# EAGLE design TinyRGBSignEdge (EAGLE 6.5.0)
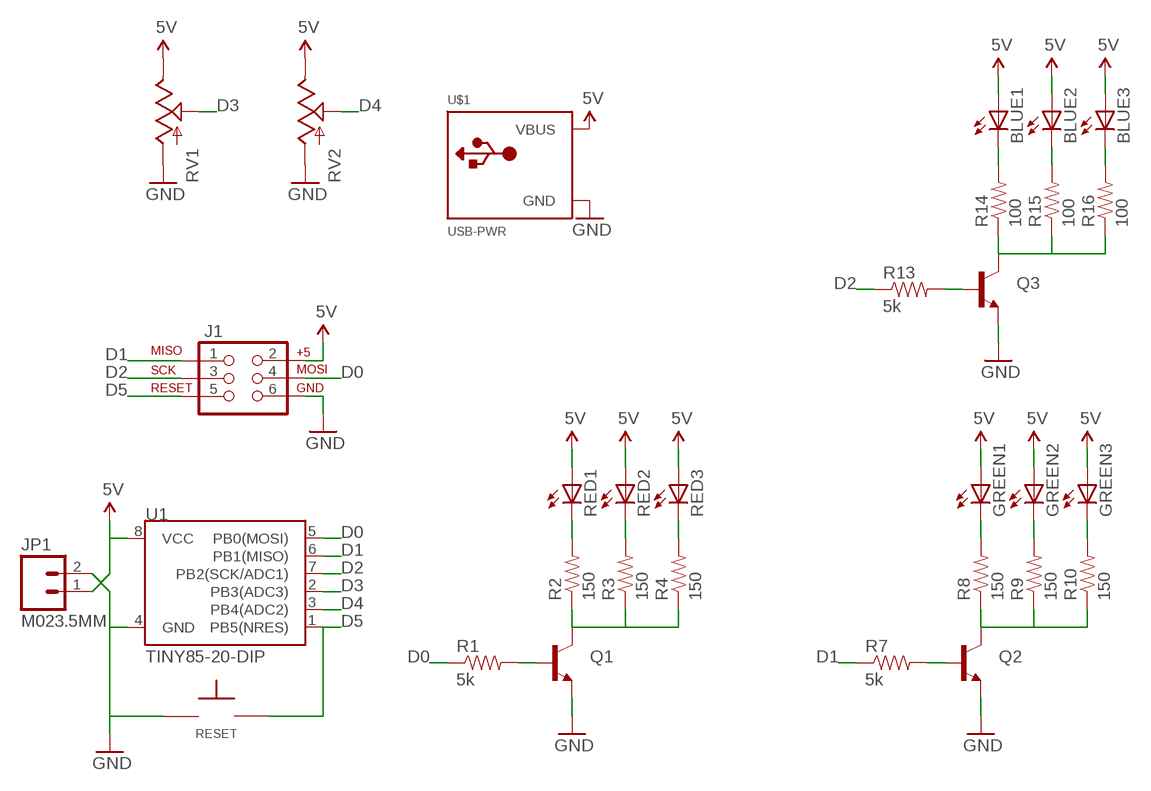
[diagram p0: schematic, sheet 1]

## Parts
BLUE1  LED5MM  [LED5MM]
BLUE2  LED5MM  [LED5MM]
BLUE3  LED5MM  [LED5MM]
GREEN1  LED5MM  [LED5MM]
GREEN2  LED5MM  [LED5MM]
GREEN3  LED5MM  [LED5MM]
J1  AVR_SPI_PRG_6PTH  [2X3]
JP1  M023.5MM  [SCREWTERMINAL-3.5MM-2]
Q1  TRANSISTOR_NPNTO-92-AMMO  [TO-92-AMMO]
Q2  TRANSISTOR_NPNTO-92-AMMO  [TO-92-AMMO]
Q3  TRANSISTOR_NPNTO-92-AMMO  [TO-92-AMMO]
R1  5k  RESISTORAXIAL-0.3  [AXIAL-0.3]
R2  150  RESISTORAXIAL-0.3  [AXIAL-0.3]
R3  150  RESISTORAXIAL-0.3  [AXIAL-0.3]
R4  150  RESISTORAXIAL-0.3  [AXIAL-0.3]
R7  5k  RESISTORAXIAL-0.3  [AXIAL-0.3]
R8  150  RESISTORAXIAL-0.3  [AXIAL-0.3]
R9  150  RESISTORAXIAL-0.3  [AXIAL-0.3]
R10  150  RESISTORAXIAL-0.3  [AXIAL-0.3]
R13  5k  RESISTORAXIAL-0.3  [AXIAL-0.3]
R14  100  RESISTORAXIAL-0.3  [AXIAL-0.3]
R15  100  RESISTORAXIAL-0.3  [AXIAL-0.3]
R16  100  RESISTORAXIAL-0.3  [AXIAL-0.3]
RED1  LED5MM  [LED5MM]
RED2  LED5MM  [LED5MM]
RED3  LED5MM  [LED5MM]
RESET  TAC_SPST_NO  [TAC_SPST_NO]
RV1  POTTRIM  [TRIM_POT]
RV2  POTTRIM  [TRIM_POT]
U1  TINY85-20-DIP  ATTINY45TINY85-20-DIP  [DIP08]
U$1  USB-PWR  [USB-MINIB-THM-MOLEX-PWRONLY]

## Nets
5V: BLUE1.A BLUE2.A BLUE3.A GREEN1.A GREEN2.A GREEN3.A J1.2 JP1.1 RED1.A RED2.A RED3.A RV1.2(E) RV2.2(E) U1.8(VCC) U$1.VBUS
BLUE2: BLUE2.K(C) R15.P$2
D0: J1.4 R1.P$1 U1.5(PB0(MOSI))
D1: J1.1 R7.P$1 U1.6(PB1(MISO))
D2: J1.3 R13.P$1 U1.7(PB2(SCK/ADC1))
D3: RV1.1(S) U1.2(PB3(ADC3))
D4: RV2.1(S) U1.3(PB4(ADC2))
D5: J1.5 RESET.P$2 U1.1(PB5(NRES))
GND: J1.6 JP1.2 Q1.1(E) Q2.1(E) Q3.1(E) RESET.P$1 RV1.3(A) RV2.3(A) U1.4(GND) U$1.GND
GREEN1: GREEN1.K(C) R8.P$2
N$2: Q1.2(B) R1.P$2
N$4: R2.P$2 RED1.K(C)
N$5: R3.P$2 RED2.K(C)
N$10: Q1.3(C) R2.P$1 R3.P$1 R4.P$1
N$12: Q2.2(B) R7.P$2
N$14: GREEN2.K(C) R9.P$2
N$15: GREEN3.K(C) R10.P$2
N$17: Q2.3(C) R8.P$1 R9.P$1 R10.P$1
N$19: Q3.2(B) R13.P$2
N$20: BLUE1.K(C) R14.P$2
N$22: BLUE3.K(C) R16.P$2
N$24: Q3.3(C) R14.P$1 R15.P$1 R16.P$1
RED3: R4.P$2 RED3.K(C)

## Library data of the parts
BLUE1-BLUE3 GREEN1-GREEN3 RED1-RED3 = barbary_enterprises:LED: LEDs Standard schematic elements and footprints for 5mm, 3mm, 1206, and 0603 sized LEDs. 5mm - Spark Fun Electronics SKU : COM-00529 (and others)
J1 = barbary_enterprises:AVR_SPI_PRG_6: AVR ISP 6 Pin This is the reduced ISP connector for AVR programming. Common on Arduino. This footprint will take up less PCB space and can be used with a 10-pin to 6-pin adapter such as SKU: BOB-08508
JP1 = SparkFun-Connectors:M02: Standard 2-pin 0.1" header. Use with - straight break away headers ( PRT-00116) - right angle break away headers (PRT-00553) - swiss pins (PRT-00743) - machine pins (PRT-00117) - female headers (PRT-00115) Molex polarized connector foot print use with: PRT-08233 with associated crimp pins and housings. 2.54_SCREWTERM for use with PRT-10571. 3.5mm Screw Terminal footprints for PRT-08084 5mm Screw Terminal footprints for use with PRT-08433
Q1-Q3 = barbary_enterprises:TRANSISTOR_NPN: Generic NPN BJT MMBT2222A - TRANS-08049 (SOT-23, 1A 40V) MPSA42 - TRANS-09116 (SOT-23, 500mA 300V) MMBT5088LT1G - TRANS-11160 (SOT-23, 50 mA 30V)
R1-R4 R7-R10 R13-R16 = barbary_enterprises:RESISTOR: Resistor Basic schematic elements and footprints for 0603, 1206, and PTH resistors.
RESET = barbary_enterprises:TAC_SPST_NO: 3,5 mm Tact Switches C&K PTS635 Series * Digi-Key Part Number: CKN9102-ND
RV1 RV2 = SparkFun-Electromechanical:POT
U1 = SparkFun-DigitalIC:ATTINY45: Atmel 8-pin 2/4/8kB flash uC; PROD_ID: IC-09445
U$1 = barbary_enterprises:USB-PWR

## Board
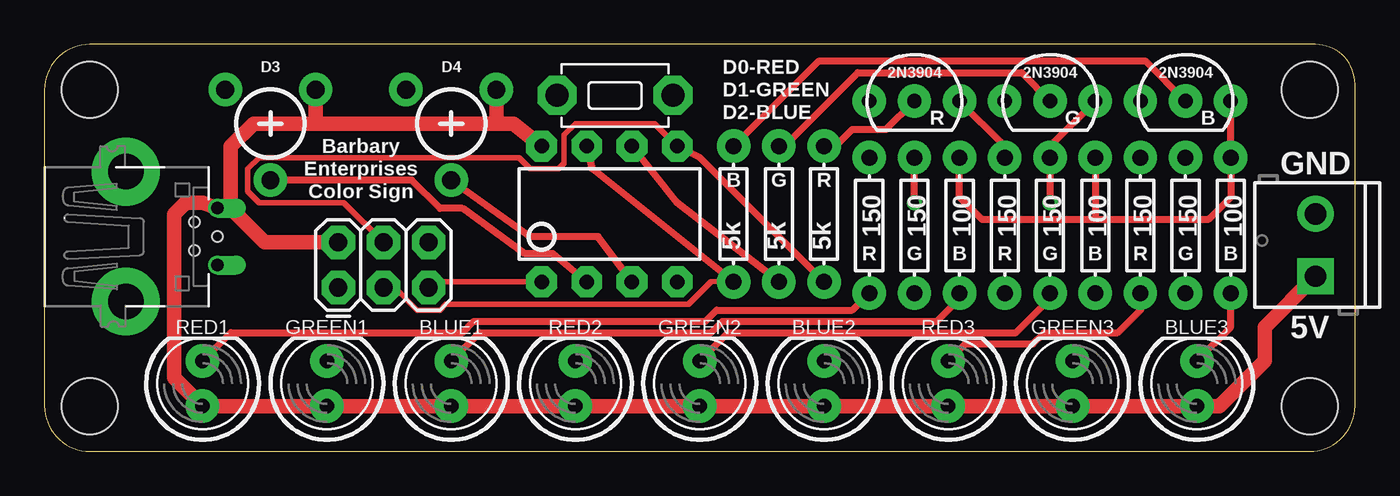
[diagram p1: board, top side]
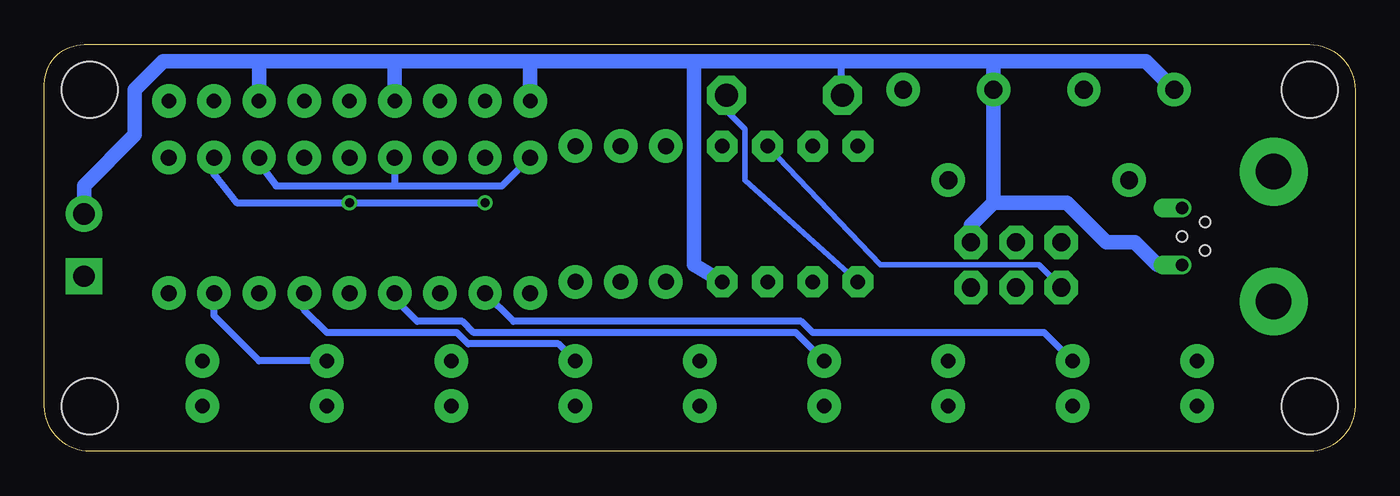
[diagram p2: board, bottom side, seen from below]

Size 73.66 x 22.86 mm. Coordinates in mm from the lower left corner, seen from the top.
Outline: 0,20.32 0,2.56 arc90 2.56,0 71.1,0 arc90 73.66,2.56 73.66,20.64 arc90 71.44,22.86 2.54,22.86 arc90 0,20.32
Copper layers (1*16): Top 0.0356mm / dielectric 1.5011mm / Bottom 0.0356mm
Design rules "LaenPCBOrder": minimum track width 6mil, minimum drill 13mil, track to track 6mil, track to pad 6mil, pad to pad 6mil, via to via 6mil, smd to smd 6mil, copper to edge 15mil, drill to drill 6mil, minimum pad ring 7mil, minimum via ring 7mil, stop-mask expansion 3mil, vias tented up to drill 0mil, thermal gap 10mil
Holes 3.17 mm at 2.54,2.54 71.12,2.54 71.12,20.32 2.54,20.32

### Footprints (pad centres in the part's own frame; a part is rotated, then mirrored left to right if it is on the bottom)
LED5MM = drill 0.813 pad 1.88: A -1.27,0; K 1.27,0
2X3 = drill 1.016 pad 1.88 octagon: 1 0,0; 2 0,2.54; 3 2.54,0; 4 2.54,2.54; 5 5.08,0; 6 5.08,2.54
SCREWTERMINAL-3.5MM-2 = drill 1.2 pad 2.032 square: 1 0,0 | drill 1.2 pad 2.032: 2 3.5,0
TO-92-AMMO = drill 0.813 pad 1.88: 1 -2.54,0; 2 0,0; 3 2.54,0
AXIAL-0.3 = drill 0.9 pad 1.88: P$1 -3.81,0; P$2 3.81,0
TAC_SPST_NO = drill 1.3 pad 2.184 octagon: P$1 -3.251,0; P$2 3.251,0
TRIM_POT = drill 1 pad 1.88: 1 5.08,0; 2 0,2.54; 3 0,-2.54
DIP08 = drill 0.813 pad 1.727 octagon: 1 -3.81,-3.81; 2 -1.27,-3.81; 3 1.27,-3.81; 4 3.81,-3.81; 5 3.81,3.81; 6 1.27,3.81; 7 -1.27,3.81; 8 -3.81,3.81
USB-MINIB-THM-MOLEX-PWRONLY = drill 0.7 offset: GND 1.6,4.64; VBUS -1.6,4.64 | drill 2 pad 3.81: GND1 -3.65,-0.51; GND4 3.65,-0.51 | hole 0.6: 0,4.648; 0.787,3.353; -0.813,3.353

### Placement (x,y rotation side)
BLUE1  22.86,3.81 90 top
BLUE2  43.81,3.81 90 top
BLUE3  64.77,3.81 90 top
GREEN1  15.88,3.81 90 top
GREEN2  36.83,3.81 90 top
GREEN3  57.78,3.81 90 top
J1  16.51,9.21 0 top
JP1  71.44,9.84 90 top
Q1  48.9,19.68 0 top
Q2  56.52,19.68 0 top
Q3  64.14,19.68 0 top
R1  43.81,13.34 90 top
R2  46.35,12.7 270 top
R3  53.98,12.7 270 top
R4  61.59,12.7 270 top
R7  41.27,13.34 90 top
R8  48.9,12.7 270 top
R9  56.52,12.7 270 top
R10  64.14,12.7 270 top
R13  38.73,13.34 90 top
R14  51.44,12.7 270 top
R15  59.05,12.7 270 top
R16  66.67,12.7 270 top
RED1  8.89,3.81 90 top
RED2  29.84,3.81 90 top
RED3  50.8,3.81 90 top
RESET  32.07,20 0 top
RV1  12.7,20.32 270 top
RV2  22.86,20.32 270 top
U1  31.75,13.34 0 top
U$1  5.08,12.06 270 top

### Tracks (layer width: path | path; a pad name or v marks a point on that pad's centre or on a via)
5V
  Top 0.813: U1.8 26.35,18.41 25.4,18.41 | 25.4,18.41 15.24,18.41 | 15.24,18.41 11.75,18.41 10.48,17.14 10.48,13.65 | 25.4,18.41 RV2.2 | RV1.2 15.24,18.41 | J1.2 12.38,11.75 10.48,13.65 | 10.48,13.65 10.49,13.66 U$1.VBUS 8.89,13.97 7.94,13.97 7.3,13.34 7.3,4.13 RED1.A GREEN1.A BLUE1.A RED2.A GREEN2.A BLUE2.A RED3.A GREEN3.A BLUE3.A 66.04,2.54 68.58,5.08 68.58,6.99 JP1.1
BLUE2
  Bottom 0.406: BLUE2.K 44.77,6.03 49.85,6.03 50.48,6.67 57.78,6.67 59.05,7.94 R15.P$2
D0
  Top 0.305: J1.4 16.83,13.97 12.06,13.97 11.43,14.61 11.43,15.88 12.06,16.51 26.67,16.51 27.3,15.88 28.89,15.88 29.21,16.19 29.21,17.78 29.84,18.41 34.29,18.41 U1.5
  Top 0.406: R1.P$1 36.83,16.51 U1.5
D1
  Top 0.406: R7.P$1 35.56,13.97 U1.6
  Bottom 0.305: J1.1 17.78,10.48 26.67,10.48 U1.6
D2
  Top 0.305: J1.3 19.68,9.21 20.95,7.94 22.23,7.94 22.54,8.26 36.2,8.26 37.47,9.53 38.1,9.59 38.35,9.84
  Top 0.406: R13.P$1 38.35,9.84 30.8,15.88 U1.7
D3
  Top 0.406: U1.2 28.57,11.11 26.99,11.11 23.5,13.65 22.23,13.65 20.64,15.24 RV1.1
D4
  Top 0.406: U1.3 31.11,12.06 27.3,12.06 RV2.1
D5
  Top 0.305: J1.5 21.91,9.53 U1.1
  Bottom 0.305: U1.1 34.29,15.24 34.29,18.1 35.32,19.13 RESET.P$2
GND
  Bottom 0.406: RESET.P$1 28.89,21.91
  Bottom 0.813: Q3.1 61.59,21.91 | 61.59,21.91 53.98,21.91 | 53.98,21.91 46.35,21.91 | Q1.1 46.35,21.91 | Q2.1 53.98,21.91 | RV1.3 11.75,21.91 20.32,21.91 | 20.32,21.91 28.89,21.91 37.15,21.91 | 37.15,21.91 46.35,21.91 | 20.32,21.91 RV2.3 20.32,13.97 | 37.15,21.91 37.15,10.48 U1.4 | J1.6 21.59,12.7 20.32,13.97 | U$1.GND 10.05,10.48 11.11,10.48 12.38,11.75 13.97,11.75 16.19,13.97 20.32,13.97 | JP1.2 71.44,14.92 68.58,17.78 68.58,20.32 66.99,21.91 61.59,21.91
GREEN1
  Bottom 0.406: GREEN1.K 17.46,6.67 30.48,6.67 31.11,7.3 47.31,7.3 R8.P$2
N$2
  Top 0.406: R1.P$2 44.45,17.14 45.4,18.1 47.31,18.1 Q1.2
N$4
  Top 0.406: RED1.K 10.48,6.67 23.5,6.67 24.13,7.3 37.15,7.3 37.78,7.94 45.4,7.94 R2.P$2
N$5
  Bottom 0.406: RED2.K 31.43,6.67 49.53,6.67 50.16,7.3 52.7,7.3 53.98,8.57 R3.P$2
N$10
  Top 0.406: R3.P$1 53.98,17.14 Q1.3
  Bottom 0.406: R4.P$1 61.59,16.19 60.64,14.92 53.98,14.92 | 53.98,14.92 47.94,14.92 R2.P$1 | R3.P$1 53.98,14.92
N$12
  Top 0.406: R7.P$2 41.59,17.14 45.72,21.27 54.93,21.27 Q2.2
N$14
  Top 0.406: GREEN2.K 38.42,6.67 54.61,6.67 56.52,8.57 R9.P$2
N$15
  Bottom 0.406: GREEN3.K 61.59,5.08 64.14,7.62 R10.P$2
N$17  (via drill 0.51)
  Top 0.406: v48.9,13.97 R8.P$1 | v56.52,13.97 R9.P$1 56.52,17.14 Q2.3
  Bottom 0.406: R10.P$1 64.14,15.56 62.87,13.97 v56.52,13.97 v48.9,13.97
N$19
  Top 0.406: Q3.2 61.91,21.91 43.5,21.91 R13.P$2
N$20
  Top 0.406: BLUE1.K 24.45,6.67 37.47,6.67 38.1,7.3 50.16,7.3 51.44,8.57 R14.P$2
N$22
  Top 0.406: BLUE3.K 66.67,6.99 R16.P$2
N$24
  Top 0.406: 59.05,13.02 65.41,13.02 66.67,14.29 R16.P$1 Q3.3 | 59.05,13.02 52.7,13.02 51.44,14.29 R14.P$1 | R15.P$1 59.05,13.02
RED3
  Top 0.406: RED3.K 51.75,6.03 55.56,6.03 56.2,6.67 60.33,6.67 61.59,7.94 R4.P$2

### Text on the board
tPlace: D3 | D4 | D0-RED | 2N3904 | 2N3904 | 2N3904 | D1-GREEN | D2-BLUE | R | G | B | Barbary | Enterprises | GND | Color Sign | B | G | R | R | G | B | R | G | B | R | G | B | 5V